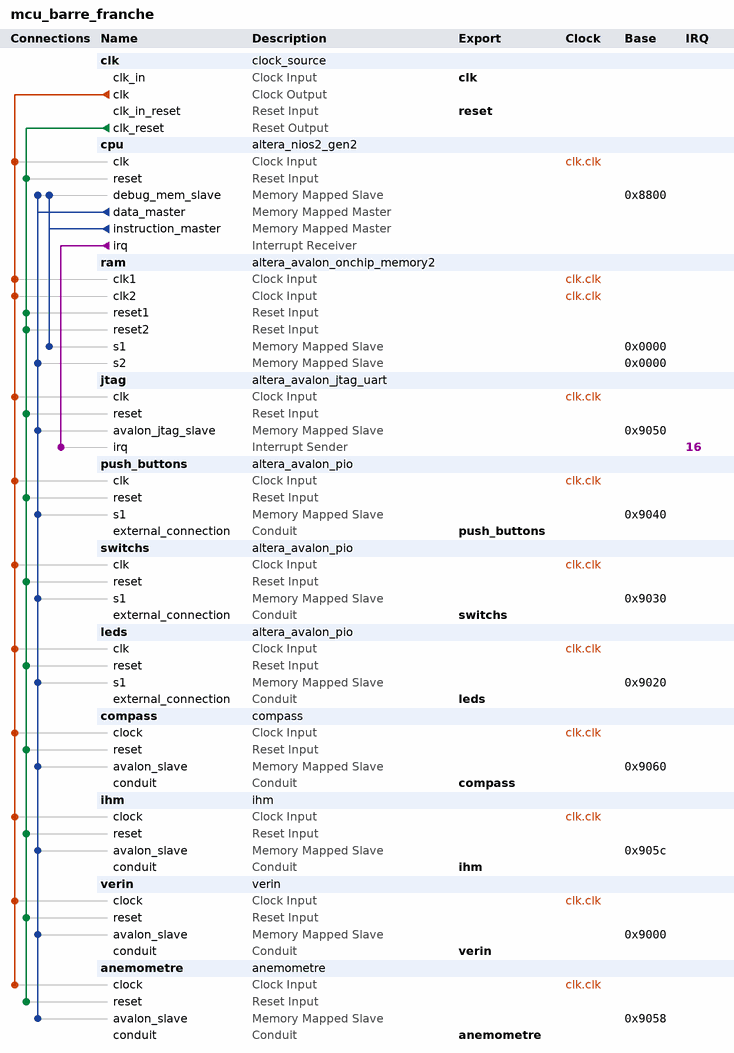
[diagram p0: system contents]
# Platform Designer (Qsys) system mcu_barre_franche, Cyclone IV E EP4CE22F17C6
# Parameters at their usual value, and those the tool derives, are not listed.
package require -exact qsys 18.1
create_system mcu_barre_franche
set_project_property DEVICE_FAMILY {Cyclone IV E}
set_project_property DEVICE EP4CE22F17C6

add_instance clk clock_source 18.1
set_instance_parameter_value clk clockFrequency 50000000

add_instance cpu altera_nios2_gen2 18.1
set_instance_parameter_value cpu dcache_size 2048
set_instance_parameter_value cpu exceptionSlave ram.s1
set_instance_parameter_value cpu icache_size 4096
set_instance_parameter_value cpu impl Tiny
set_instance_parameter_value cpu resetSlave ram.s1

add_instance ram altera_avalon_onchip_memory2 18.1
set_instance_parameter_value ram dataWidth 32
set_instance_parameter_value ram dualPort true
set_instance_parameter_value ram initMemContent true
set_instance_parameter_value ram initializationFileName onchip_mem.hex
set_instance_parameter_value ram memorySize 32768

add_instance jtag altera_avalon_jtag_uart 18.1
set_instance_parameter_value jtag simInteractiveOptions NO_INTERACTIVE_WINDOWS

add_instance push_buttons altera_avalon_pio 18.1
set_instance_parameter_value push_buttons direction Input
set_instance_parameter_value push_buttons width 1

add_instance switchs altera_avalon_pio 18.1
set_instance_parameter_value switchs direction Input
set_instance_parameter_value switchs width 4

add_instance leds altera_avalon_pio 18.1
set_instance_parameter_value leds direction Output
set_instance_parameter_value leds width 8

add_instance compass compass 1.0

add_instance ihm ihm 1.0

add_instance verin verin 1.0

add_instance anemometre anemometre 1.0

# connections
add_connection clk.clk anemometre.clock clock
add_connection clk.clk compass.clock clock
add_connection clk.clk cpu.clk clock
add_connection clk.clk ihm.clock clock
add_connection clk.clk jtag.clk clock
add_connection clk.clk leds.clk clock
add_connection clk.clk push_buttons.clk clock
add_connection clk.clk ram.clk1 clock
add_connection clk.clk ram.clk2 clock
add_connection clk.clk switchs.clk clock
add_connection clk.clk verin.clock clock
add_connection clk.clk_reset anemometre.reset reset
add_connection clk.clk_reset compass.reset reset
add_connection clk.clk_reset cpu.reset reset
add_connection clk.clk_reset ihm.reset reset
add_connection clk.clk_reset jtag.reset reset
add_connection clk.clk_reset leds.reset reset
add_connection clk.clk_reset push_buttons.reset reset
add_connection clk.clk_reset ram.reset1 reset
add_connection clk.clk_reset ram.reset2 reset
add_connection clk.clk_reset switchs.reset reset
add_connection clk.clk_reset verin.reset reset
add_connection cpu.data_master anemometre.avalon_slave avalon
set_connection_parameter_value cpu.data_master/anemometre.avalon_slave baseAddress 0x9058
add_connection cpu.data_master compass.avalon_slave avalon
set_connection_parameter_value cpu.data_master/compass.avalon_slave baseAddress 0x9060
add_connection cpu.data_master cpu.debug_mem_slave avalon
set_connection_parameter_value cpu.data_master/cpu.debug_mem_slave baseAddress 0x8800
add_connection cpu.data_master ihm.avalon_slave avalon
set_connection_parameter_value cpu.data_master/ihm.avalon_slave baseAddress 0x905c
add_connection cpu.data_master jtag.avalon_jtag_slave avalon
set_connection_parameter_value cpu.data_master/jtag.avalon_jtag_slave baseAddress 0x9050
add_connection cpu.data_master leds.s1 avalon
set_connection_parameter_value cpu.data_master/leds.s1 baseAddress 0x9020
add_connection cpu.data_master push_buttons.s1 avalon
set_connection_parameter_value cpu.data_master/push_buttons.s1 baseAddress 0x9040
add_connection cpu.data_master ram.s2 avalon
set_connection_parameter_value cpu.data_master/ram.s2 baseAddress 0x0000
add_connection cpu.data_master switchs.s1 avalon
set_connection_parameter_value cpu.data_master/switchs.s1 baseAddress 0x9030
add_connection cpu.data_master verin.avalon_slave avalon
set_connection_parameter_value cpu.data_master/verin.avalon_slave baseAddress 0x9000
add_connection cpu.instruction_master cpu.debug_mem_slave avalon
set_connection_parameter_value cpu.instruction_master/cpu.debug_mem_slave baseAddress 0x8800
add_connection cpu.instruction_master ram.s1 avalon
set_connection_parameter_value cpu.instruction_master/ram.s1 baseAddress 0x0000
add_connection cpu.irq jtag.irq interrupt
set_connection_parameter_value cpu.irq/jtag.irq irqNumber 16

# exported interfaces
add_interface anemometre conduit end
set_interface_property anemometre EXPORT_OF anemometre.conduit
add_interface clk clock sink
set_interface_property clk EXPORT_OF clk.clk_in
add_interface compass conduit end
set_interface_property compass EXPORT_OF compass.conduit
add_interface ihm conduit end
set_interface_property ihm EXPORT_OF ihm.conduit
add_interface leds conduit end
set_interface_property leds EXPORT_OF leds.external_connection
add_interface push_buttons conduit end
set_interface_property push_buttons EXPORT_OF push_buttons.external_connection
add_interface reset reset sink
set_interface_property reset EXPORT_OF clk.clk_in_reset
add_interface switchs conduit end
set_interface_property switchs EXPORT_OF switchs.external_connection
add_interface verin conduit end
set_interface_property verin EXPORT_OF verin.conduit

set_interconnect_requirement {$system} qsys_mm.clockCrossingAdapter HANDSHAKE
set_interconnect_requirement {$system} qsys_mm.enableEccProtection FALSE
set_interconnect_requirement {$system} qsys_mm.insertDefaultSlave FALSE
set_interconnect_requirement {$system} qsys_mm.maxAdditionalLatency 1

save_system mcu_barre_franche.qsys
